# Altium schematic sheet Sheet2.SchDoc
size A; SheetNumber: 2; SheetTotal: 3; SPICEModelCacheSNXRSEFX: <root> / <DocumentId>SNXRSEFX</DocumentId> / <CacheFrame Number="0"> / <Model Name="lp5907_3p0_trans" Kind="CKT"> / <Text>**$ENCRYPTED_LIB / **$INTERFACE / * PSpice Model Editor - Version 16.2.0 / *$ / * LP5907_3P0 / ***************************************************************************** / * (C) Copyright 2017,2012 Texas Instruments Incorporated. All rights reserved. / ***************************************************************************** / ** This model is designed as an aid for customers of Texas Instruments. / ** TI and its licensors and suppliers make no warranties, either expressed / ** or implied, with respect to this model, including the warranties of / ** merchantability or fitness for a particular purpose. The model is / ** provided solely on an "as is" basis. The entire risk as to its quality / ** and performance is with the customer. / ***************************************************************************** / * / * This model is subject to change without notice. Texas Instruments / * Incorporated is not responsible for updating this model. / * / ***************************************************************************** / * / ** Released by: WEBENCH Design Center, Texas Instruments Inc. / * Part: LP5907_3P0 / * Date: 05JUN2017 / * Model Type: Transient / * Simulator: PSPICE / * Simulator Version: 16.2.0.p001 / * EVM Order Number: / * EVM Users Guide: / * Datasheet: SNVS798L APRIL 2012REVISED SEPTEMBER 2016 / * / * / * Model Version: Final 1.10 / * / ***************************************************************************** / * / * Updates: / * / * Final 1.10 / * Release to Web / *&lt;Made below changes to the model&gt; / * 1. Model supports floating ground and made compliant with new template. / * / * Final 1.00 / * Release to Web / * / ***************************************************************************** / * / * Model Usage Notes: / * / * 1. The following features have been modeled / *      a. Start-up time / *      b. PSSR / *      c. Enable/VIN shutdown / *      d. Load and line transients / *      e. Internal current limit / *      f. Model supports inverting topology. / * / * / * 2. Temperature effects &amp; Ground/quiescent current have not been modeled. / * / ***************************************************************************** / .SUBCKT LP5907_3P0_TRANS EN VIN VOUT N_C GND / $CDNENCSTART / eee8c5c7a2bc4b01f045f303678664e7916da0bae22e8cb0bba041dd67c69ce448ea70148a9ac1670c8926c1ac5057c8ccfcd77bf87ca9dc1f2237338a6ef39d / 0dea85bdd2f6170515f60e4ce62d5ce4f42b1ac717dd32555170a8e333648715f562e78474a33860560cb52aa9aabd08162db2a33972403f8ec095416ef1402c / 23ee73d6065f3641a60fd3951de4fe94e0b5dbf27fe7bf8f8855cd663d22bb25644126c9831a96bdc8e5a32375110da8033006ed9ac5d2d19e3592265a7ac25a / c9df73872fc604505141f95a167e875cb8368eb63c4c192b1dbaaf9d294d8e9748da025e697215716ac3f3c79dcf3e27303d7240d8c3139d1f2237338a6ef39d / c6ada2f6665016df0abfc569c2f155649bb0d004119ec15edac27046788386e08c268da1b8c6e14d7fe15ab6e0b5072f9f339ae728025ac59258806fc7cc43d8 / 6f9764b062a618461b335ff6669122153465e12ae9d7d9c7a434cb3c571aa35fcf8e67772046bd39de85e4e2d68b498f6dba65afb526cbc1a2029afaa2b4a68e / 0be1bd08545f4ec3706b807646b80371d6b573c4fef92654bdbd52ddbaa047e44f8bfb77fa42da9ca5c0f1a70fbc358fb8558acfd32419a886391aa7db33436a / 82d2e7992b7a58af706b807646b803716eccaf694fc8cbd852bd4e0d98b91e0393c1d0241c58b19c8c1b61a2a3408b1c3b31ab4d5157bebb045e35488dc8d857 / 96cc4b5209c35bf775963efd3ee34e16f562e78474a33860560cb52aa9aabd08162db2a33972403f2b4240fc250814d9757d9762d76573a2de58ab941dd37bc2 / cdaa385411811e27bfd81d659a09e4b32637e9cac2aa5cea2cecad1ebf804c4bf467148f06ca8e43b386cdd95d344e224c0b6f0d39a92da161003feb9e39e6bc / 5aa875be979324eb706b807646b803717dcd3f16f2f4a72c7eda79482ff3735885c2b9ec79784b734f171b0ac1178905b3e9d0eff77948c660f3e64cab793fd4 / 6dcc2999c2dfe559706b807646b8037152bd4e0d98b91e036547a759992af1d01ed3b068a02ead27a5c0f1a70fbc358fb8558acfd32419a886391aa7db33436a / 0a40497471b1851d706b807646b8037110fe20894a82e47899b87aceb23e86979bd52e24aaba9e8d7538df4596c8873b644126c9831a96bddad715ff2fd3051c / 311fb123761f1dd1939d8e8a60715c719bce09d5b25a2abbebab489077a612d43deed04c860f4203446c0a8b5840e648b6adb3acb41df66c7a119c9a925e903a / 999885ffe318eff0a5c0f1a70fbc358fb8558acfd32419a8e52b5eff4bb48eb945ddc6a4b72796469aa0f149b272f6822a0a30f438cac9930696f6a37d129d35 / e9f419af62bfe95eb585b96681e0ca9ba21192fade6c61218492e52ca990713774bd84a1f90ee88cdd6200a649fb305b94754a223418ccdb2be4545d89eca38c / 6d35d8485846d69902bd25eaa8c8a8117df3afe1fbfc11e3dc7abd4485ee9f8e6290bd1a849bbcaaf829d8c08e2df90b3e7542e0267ca578508313674356fb94 / 10f459d39ee6f8ae706b807646b80371a4f10b3120454571f2810f0bed6a6bb9267ed4ac3759fd051c6ffcdd96e3dd45844da759261db9861f2237338a6ef39d / 69ff18044fae7c89706b807646b8037152bd4e0d98b91e03a4a705036dcc71cc1471cd15dabb62faa5c0f1a70fbc358fb8558acfd32419a886391aa7db33436a / 1e36f10390632b7b706b807646b8037152bd4e0d98b91e03d126183a007ec7da5a3bd16bf5766b7522c2ca6031933b14abdc18ad19c6370052dba193271012d0 / bee3b1535c1d5d6b644126c9831a96bdc8e5a32375110da8033006ed9ac5d2d1afd69b5275785a510a61135c65b4240f7f2bbe2210c0cd5b5bc1a718246f5080 / 22cc75479b3d980a706b807646b8037180a93b86ccc5ef96b81e4c4d969f1dd2ca3bf768e25b6b29ac6a06391c26b0c664bcc0a497fc04bab60ed022882a5e96 / 1ac3d64a7ec42565706b807646b80371fafbb00062b4cc8e5a87424d006993fbf4ff3965adf04b6de23d827c2a5cdd2f1d40db20570fad7864386207709a88c4 / a8fd19f33527d4f2b045c149b70fbd518c268da1b8c6e14d7fe15ab6e0b5072f9f339ae728025ac5f9ddf8ad585c1707b0641cfbbf3b64bdb8c03661254f4d72 / cdaa385411811e27bfd81d659a09e4b32637e9cac2aa5cea2cecad1ebf804c4bf467148f06ca8e43b386cdd95d344e224c0b6f0d39a92da161003feb9e39e6bc / 54653036f112a7e5706b807646b80371989ff71a450f2d4f43ff7de80bac908e0b2915792e5120cd0afc85f6633d60b0042f0c0c78bb0deba2029afaa2b4a68e / 9d3782a54af54f6d706b807646b80371989ff71a450f2d4f880b50147c27929900877b91cd4279f39377af7e54bb163fc1303b74a0359d38f6c8b208a55c3008 / 8df0563ff6b12bcb706b807646b803717dcd3f16f2f4a72c970368879395e64fb108abd8f0d8760ca5c0f1a70fbc358fb8558acfd32419a886391aa7db33436a / f28257b2a3730294706b807646b80371a847f3fb487c186c2e10b6f40aa50ec73034a5f774424fca02bd25eaa8c8a8117df3afe1fbfc11e3642308046b4ea694 / a5d158a0fc11634f706b807646b8037180a93b86ccc5ef96dcdb6b3481be0e8956bfede5d11cc7ca4f171b0ac1178905b3e9d0eff77948c660f3e64cab793fd4 / e9f419af62bfe95ec12e63f53fc8b6c7080dbdc2111b05ac8137f3f5199c34a1ce5ec34e6f8ad1ca5a7677ff1b3f4c2798db71085172481be0e3731929278ec6 / 3487eaf1c64d3e9be98f5b980e01c859aa11a96fd77a05cac8e5a32375110da8033006ed9ac5d2d1afd69b5275785a510a61135c65b4240ff30e0e5d2ed91cb1 / ce7c56cb096546916589144859c4b12fb5f1c17ee7956303b386cdd95d344e224c0b6f0d39a92da103c1359a395fea4edf42d85a8257809120f58e0d0db27768 / e9f419af62bfe95ebc27f931268b4061080dbdc2111b05ac281216a7cb15249ace5ec34e6f8ad1cac13ffc8b6ae5cb2e4c21dace8c0b77c7ecd58aec06da121d / 5d078000650a8fa5907b99823f1386611647afe0495b1ace45b47fa4a900dd804f447fc7bfeaab9e02bd25eaa8c8a8117df3afe1fbfc11e3642308046b4ea694 / a3ce589fda26bc39706b807646b80371989ff71a450f2d4f552dbe3b9f96257d713efb65723a80ebd53698db8c1cb0e024fdfd9bb2e10b07b60ed022882a5e96 / f9b0e0bab8595c63706b807646b803710c93db79923e59d4d97ed74d8488316a1fd0fe96cad713b855371616c1c9f36f1c805e0c37824e95e89729e5d38ef58f / e9f419af62bfe95ecc0121b5e20e2076080dbdc2111b05acde91212396735d2ace5ec34e6f8ad1caf93f7b40a8e2bd3108c0f85e1bde808a956711648fdaafb1 / 0a74212461f65cb976d50cd002ed44083e433ab1299f423f6954020319aab50ff562e78474a33860560cb52aa9aabd08162db2a33972403f8ec095416ef1402c / bc8ee2299b220803beda7935c8aeca8d90d894e251243331dc0745283a910a9d564ac05b97e34c8c3343357705743cd11b1b8528953e7c05c5653993202dbdc5 / 02dac6cba784505e706b807646b8037180a93b86ccc5ef961fd0fe96cad713b8ec673e334d6e7ccd24fdfd9bb2e10b07a5c0f1a70fbc358fd92a745ddd778fe4 / b67df0d3ab862a12706b807646b80371a847f3fb487c186c7546fb5c8c4298ec3034a5f774424fca02bd25eaa8c8a8117df3afe1fbfc11e3642308046b4ea694 / bedb4c285028d3890abfc569c2f155648a39127aa9f8cf3378b54ce720b1001e5b9f79f666c8fe0048c4805203a5c1374f171b0ac1178905fd2707d3f952d1fb / 5637fcfd860683a92531ce9df5eb060381d6b57981cd92143fcc20578536d17e644126c9831a96bdc8e5a32375110da8033006ed9ac5d2d19e3592265a7ac25a / 48a94d11d238250f1e8d99a34d90bf6e62e88611cf6e71252d04475a671a0efda43968df6d6616e3b5582e7414710ac9644126c9831a96bddad715ff2fd3051c / e644fc3843e7ff1b15f60e4ce62d5ce4a468356d867f8b503a870bda96023ed7f6bdaa4da8832bb84f171b0ac1178905b3e9d0eff77948c660f3e64cab793fd4 / 336ab444b7c2ade71b335ff6669122150e68485587411f9a8492e52ca99071375bebda023e3dc91e71802e7452fd18b248c4805203a5c137f2f761ab7704e778 / a3f576b848cd34f915f60e4ce62d5ce4b8a226473598a56b027888eba959f92eb19075ca5679628a564ac05b97e34c8c3343357705743cd1f2b50d82304ae07a / 4036fe3bb1fccadcf45310c19b6b8ee599a0991fc74259832333a016061f78ba24fdfd9bb2e10b07a5c0f1a70fbc358fb8558acfd32419a886391aa7db33436a / 93d3808648446fd760c210771409cb2ee0b5dbf27fe7bf8f28012d945d685fb43bfc0ce7f97e07f14f171b0ac1178905b3e9d0eff77948c660f3e64cab793fd4 / 3d438685e8d81df08ce6c355cecd73173a9f2b15e1549f82d2cba97a6fa780a058b7694ea940380f4aad8c443740098ea8c91e20f198ecd4b60ed022882a5e96 / c0ff0c48b49f7f336b2aa09c0af3df1469b84f995ab9051c8e9fda988b24bba9c64d81576cf5798f00d3e0b087c737444f171b0ac1178905fd2707d3f952d1fb / c858d814c56a2bccc83805c2174809e89f01b7b69d9219a4f0974baff00f663252a385cff0ff5105bd64bf1a73d7cdffcdbbb8dee99590171f2237338a6ef39d / b0eb42ca922cce592fbfcc2b872ff946b18d7f6c9478f926749d13634498f34b68c3b9926e0df71ceaaf7045263d8c48311203d0aeae6b284549675fbefb5cdc / 878ea891db46c1cd9b17b472ccd6ffe7644126c9831a96bdc8e5a32375110da8033006ed9ac5d2d1afd69b5275785a510a61135c65b4240ff30e0e5d2ed91cb1 / be933631531f965902bd25eaa8c8a8117df3afe1fbfc11e3dc7abd4485ee9f8e6290bd1a849bbcaaf829d8c08e2df90b3e7542e0267ca578508313674356fb94 / 9afa1f10a7f457ea15f60e4ce62d5ce4268ffed78a3448457725dab847e703f63d1e66e16b42006a644126c9831a96bdc8e5a32375110da889a2796fbfb67ca0 / 5c2e262d493b312f305eaeda4ae775d7c195100027f00a3fba105b629766a2e000d3e0b087c737444f171b0ac1178905b3e9d0eff77948c660f3e64cab793fd4 / 5f41a7a4794b53672c4cbab029189320d042b92eba138a7c9f7df7e1d8537137dc26028ef70590f4b5f1c17ee7956303b386cdd95d344e22338cb575f6b9cea3 / ddf70eae3b592905a60fd3951de4fe94b6c5413836fc187c4b41ee992fe28b1ff562e78474a33860560cb52aa9aabd08162db2a33972403f8ec095416ef1402c / e0bee0f3fadd672460c210771409cb2ee0b5dbf27fe7bf8f1f2fb368fccc6be125d40f775a64a0940cafcb7cfe652d94bf1ee911780421dd1f2237338a6ef39d / f80a395284a571112fbfcc2b872ff9468e9fda988b24bba9e5e7fade4086c0d1d3b99b01fef3c644b016893e7e47cfd682b96d0b5ade7e97484379fba1bca2d2 / 062e5f2e0baf1b671b335ff6669122158a831dedbf5e05f78492e52ca99071374791d9b7e0db60db3efcea856e03cbcb8c268da1b8c6e14d89160f2754c96160 / 705d459f50f7a08c15f60e4ce62d5ce4b1e7b82b4260120d8f71e7553e806398042f0c0c78bb0deb564ac05b97e34c8c3343357705743cd1f2b50d82304ae07a / 394197bedeb77a71acab1d0766be876cdc171ccd3489847ae1dccbcbafa30549bf1ee911780421ddb386cdd95d344e224c0b6f0d39a92da161003feb9e39e6bc / b052355e65d40bda1e8d99a34d90bf6ec9ff7abb021b1d34250ab162ede77ed0bbc3d254e7d5d10548f47e6a1b8fd4c6a1943618832707cff2f761ab7704e778 / b90e0c5fe970b38760c210771409cb2e9bb0d004119ec15e777d4715d3c53dd141d49fca179af79dbaee13068f3f98a9dfe18481da70a6599d6bedf9d0034ac8 / 904e90e8e5b2fbfdf45310c19b6b8ee599a0991fc74259832333a016061f78ba24fdfd9bb2e10b07a5c0f1a70fbc358fb8558acfd32419a886391aa7db33436a / 615a28c46d72374094fbbbfac28a5c5c164c9e232793a5b0e99f6ae89c8b7ae302bd25eaa8c8a8117df3afe1fbfc11e3dc7abd4485ee9f8e06f446f73ef208be / 2f646e0e8d7ca9fb860341bb47536c89d3c6f4cd3b9e53669f7df7e1d853713798709113e7ea04d2b5f1c17ee7956303b386cdd95d344e22338cb575f6b9cea3 / 717cdf892ff6b6ffa60fd3951de4fe94f62cc45356863029bf1ee911780421ddb386cdd95d344e224c0b6f0d39a92da103c1359a395fea4e2547cfd16916d128 / 6a30044ee8eb8b67df94e35e4efbe801a81b64b03c55448366eaeb9fc4cc8ae1d7fdd13664b19a3da770ffc06755e0b9564ac05b97e34c8c1ec113823609ffcc / 2cfd781695004e385050367ff4393fd0f5957e86a35dee97669eef4894e6ebd591d2aeffe375b62981f87bf823608f41a6f0273a70365cec890995cd4f67537c / d8085d82d8686840ed8ce2e705c14ecfc8e5a32375110da8033006ed9ac5d2d1afd69b5275785a510a61135c65b4240f7f2bbe2210c0cd5b5bc1a718246f5080 / 47d63904790b4c5b964cb18042fc708b34fecbdc2e9ff42a885a6f1714ca32ab8b8d03f66b3294c2e1dfb3f47a4ac658dc67d6d46927fdbdf2f761ab7704e778 / $CDNENCFINISH / .ENDS LP5907_3P0_TRANS</Text> / </Model> / </CacheFrame> / </root>
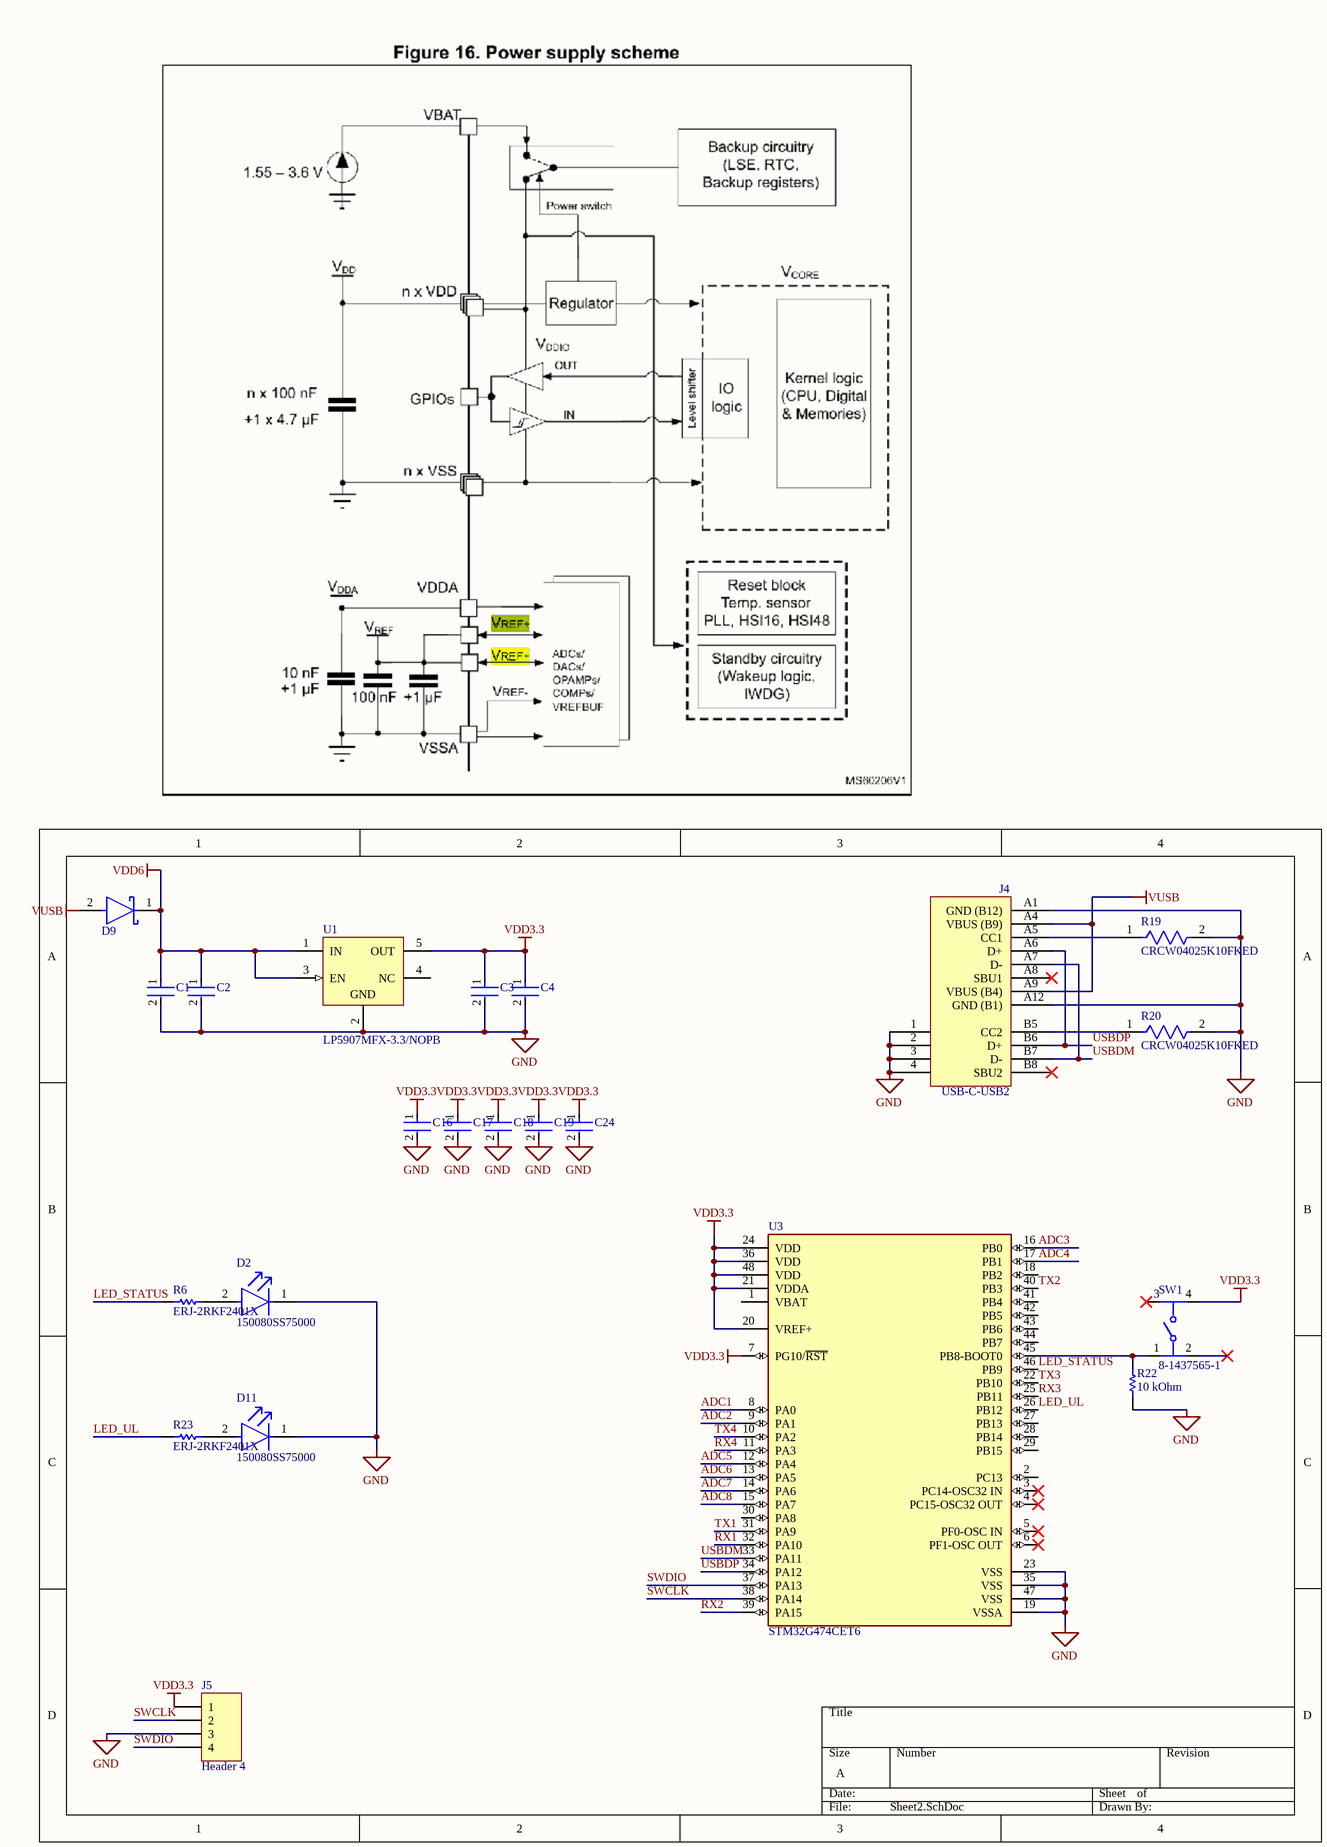
[diagram p0: Sheet2.SchDoc]

## Parts
C1  C0603C225K4PACTU  [FP-C0603C225K4PACTU-MFG]  (value not drawn)
C2  C0603C225K4PACTU  [FP-C0603C225K4PACTU-MFG]  (value not drawn)
C3  C0603C225K4PACTU  [FP-C0603C225K4PACTU-MFG]  (value not drawn)
C4  C0603C225K4PACTU  [FP-C0603C225K4PACTU-MFG]  (value not drawn)
C16  C0603C225K4PACTU  [FP-C0603C225K4PACTU-MFG]  (value not drawn)
C17  C0603C225K4PACTU  [FP-C0603C225K4PACTU-MFG]  (value not drawn)
C18  C0603C225K4PACTU  [FP-C0603C225K4PACTU-MFG]  (value not drawn)
C19  C0603C225K4PACTU  [FP-C0603C225K4PACTU-MFG]  (value not drawn)
C24  C0603C225K4PACTU  [FP-C0603C225K4PACTU-MFG]  (value not drawn)
D2  150080SS75000  [FP-150080SS75000-MFG]
D9  VS-10MQ100NTRPBF  [FP-95400-MFG]  (value not drawn)
D11  150080SS75000  [FP-150080SS75000-MFG]
J4  USB-C-USB2  [USB-C-USB4105]
J5  Header 4  [HDR1X4]
R6  ERJ-2RKF2401X  [RESC1005X40X25LL05T05]
R19  CRCW04025K10FKED  [FP-CRCW0402-e3-IPC_C]
R20  CRCW04025K10FKED  [FP-CRCW0402-e3-IPC_C]
R22  value 10 kOhm  [RESC1005X40X25LL05T10]  (hidden comment: RC0402FR-0710KL)
R23  ERJ-2RKF2401X  [RESC1005X40X25LL05T05]
SW1  8-1437565-1  [FP-8-1437565-1-MFG]
U1  LP5907MFX-3.3/NOPB  [DBV0005A_N]
U3  STM32G474CET6  [FP-STM32G474CET6-MFG]

## Nets
GND: C1.2 C2.2 C3.2 C4.2 C16.2 C17.2 C18.2 C19.2 C24.2 D2.1(C) D11.1(C) J4.1(CHASIS) J4.2(CHASIS) J4.3(CHASIS) J4.4(CHASIS) J4.A1(GND_(B12)) J4.A12(GND_(B1)) J5.3 R19.2 R20.2 R22.1 U1.2(GND) U3.19(VSSA) U3.23(VSS) U3.35(VSS) U3.47(VSS)
VDD3.3: C3.1 C4.1 C16.1 C17.1 C18.1 C19.1 C24.1 J5.1 SW1.4 U1.5(OUT) U3.7(PG10/~{RST}) U3.20(VREF+) U3.21(VDDA) U3.24(VDD) U3.36(VDD) U3.48(VDD)
VDD6: C1.1 C2.1 D9.1(C) U1.1(IN) U1.3(EN)
VUSB: D9.2(A) J4.A4(VBUS_(B9)) J4.A9(VBUS_(B4))
ADC1: U3.8(PA0)
ADC2: U3.9(PA1)
ADC3: U3.16(PB0)
ADC4: U3.17(PB1)
ADC5: U3.12(PA4)
ADC6: U3.13(PA5)
ADC7: U3.14(PA6)
ADC8: U3.15(PA7)
LED_STATUS: R6.1 U3.46(PB9)
LED_UL: R23.1 U3.26(PB12)
RX1: U3.32(PA10)
RX2: U3.39(PA15)
RX3: U3.25(PB11)
RX4: U3.11(PA3)
SWCLK: J5.2 U3.38(PA14)
SWDIO: J5.4 U3.37(PA13)
TX1: U3.31(PA9)
TX2: U3.40(PB3)
TX3: U3.22(PB10)
TX4: U3.10(PA2)
USBDM: J4.A7(D-) J4.B7(D-) U3.33(PA11)
USBDP: J4.A6(D+) J4.B6(D+) U3.34(PA12)
NetD2_2: D2.2(A) R6.2
NetD11_2: D11.2(A) R23.2
NetJ4_A5: J4.A5(CC1) R19.1
NetJ4_B5: J4.B5(CC2) R20.1
NetR22_2: R22.2 SW1.1 U3.45(PB8-BOOT0)

Not connected (* = marked no-connect by the designer): J4 A8(SBU1)* B8(SBU2)*; SW1 2* 3*; U1 4(NC); U3 1(VBAT) 2(PC13) 3(PC14-OSC32_IN)* 4(PC15-OSC32_OUT)* 5(PF0-OSC_IN)* 6(PF1-OSC_OUT)* 18(PB2) 27(PB13) 28(PB14) 29(PB15) 30(PA8) 41(PB4) 42(PB5) 43(PB6) 44(PB7)

## Library data of the parts
C1-C4 C16-C19 C24 = CMP-2006-02259-2: CAP CER 2.2UF 16V X5R 0603; Dielectric Material: Ceramic; Tolerance: 10%; Dissipation Factor: 5%; Series: C; Voltage Rating (DC): 16V; REACH SVHC: No SVHC; RoHS Compliant: Yes; Number of Pins: 2; Max Operating Temperature: 85°C; Voltage Rating: 16V; Min Operating Temperature: -55°C; Termination: SMD/SMT; Dielectric: X5R; Packaging: Tape and Reel; Contact Plating: Tin; Case Code (Metric): 1608; Height: 0.8mm; Capacitance: 2.2uF; Case/Package: 0603; Width: 0.8mm; Construction: Flat; Depth: 0.8mm; Thickness: 0.034inch; Radiation Hardening: No; Length: 1.6mm; Mount: Surface Mount; Case Code (Imperial): 0603; Voltage: 16V; Package Quantity: 1; Lead Free: Lead Free; LCSC: C23630
D2 D11 = CMP-1426-00010-2: LED RED CLEAR 0805 SMD; Forward Voltage: 1.9V; Luminous Intensity: 60mcd; Dominant Wavelength: 630nm; Forward Current: 30mA; Viewing Angle: 140°; Lens Color: Colorless; Test Current: 20mA; Lens Size: 1.25mm; Packaging: Cut Tape; Width: 1.25mm; Case Code (Metric): 2012; Max Operating Temperature: 85°C; RoHS Compliant: Yes; Mount: Surface Mount; Case/Package: 0805; Series: WL-SMCW; Length: 2mm; Case Code (Imperial): 0805; Wavelength: 630nm; Lens Style: Clear; Min Operating Temperature: -40°C; Color: Red; Lens Transparency: Clear; Package Quantity: 1; Height: 0.8mm; LCSC: C84256
D9 = CMP-02539-000001-1: DIODE SCHOTTKY 100V 1A SMA; Manufacturer: Vishay; Forward Current: 1.5A; Max Surge Forward Current: 30A; Standoff Height: 0mm; Value: 38pF; Max Junction Temp: +150°C; Peak Reverse Current: 0.1mA; Octopart: https://octopart.com/vs-10mq100ntrpbf-vishay-44340924; Max Repetitive Reverse Voltage: 100V; ComponentLink2Description: Datasheet; ComponentLink2URL: http://www.vishay.com/docs/94119/vs-10mq100ntrpbf.pdf; Reverse Voltage: 100V; Digikey Description: DIODE SCHOTTKY 100V 1A SMA; Mouser Description: DIODE SCHOTTKY 100V 1A SMA; Lead Free: Yes; Device Class L2: Diodes; Temperature Range Low: -55°C; Package: 95400; Height: 2.29mm; Capacitance: 38pF; Device Class L1: Discrete Semiconductors; Footprint Url: https://www.vishay.com/docs/95400/sma.pdf; Temperature: -55°C to +150°C; Temperature Range High: +150°C; RoHS: TRUE; Category: Diode; Manufacturer Part Number: VS-10MQ100NTRPBF; Device Class L3: Schottky Diodes; Automotive: No; LCSC: C14996
J4 = USB-C-USB2: MP: USB4105; MF: Global Connector Technology; LCSC: C2927039
J5 = Header 4: Header, 4-Pin; LatestRevisionDate: 17-Jul-2002; LatestRevisionNote: Re-released for DXP Platform.; Publisher: Altium Limited
R6 R23 = CMP-2002-00798-1: Manufacturer: Panasonic; Part Number: ERJ-2RKF2401X; LCSC: C25130
R19 R20 = CMP-1011-00590-4: RES Thick Film, 5.1kΩ, 1%, 0.063W, 100ppm/°C, 0402; Voltage Rating: 50V; Max Power Dissipation: 63mW; Resistance: 5.1kR; Case/Package: 0402; Min Operating Temperature: -55°C; Height: 0.35mm; Contact Plating: Tin; Tolerance: 1%; Max Operating Temperature: 155°C; Lead Free: Lead Free; Number of Terminations: 2; Temperature Coefficient: 100ppm/°C; Weight: 2.3E-05oz; Termination: SMD/SMT; Radiation Hardening: No; Voltage Rating (DC): 50V; Length: 1mm; Features: Automotive AEC-Q200; Case Code (Metric): 1005; Width: 0.02inch; Package Quantity: 10; Military Standard: Not; Depth: 0.5mm; Packaging: Tape and Reel; Power Rating: 63mW; Case Code (Imperial): 0402; Composition: Thick Film; LCSC: C25905
R22 = CMP-2002-07353-1: Manufacturer: Yageo / Phycomp; Part Number: RC0402FR-0710KL; LCSC: C25744
SW1 = CMP-03407-000016-1: SWITCH TACTILE SPST-NO 0.02A 15V; Actuator Length: 0.4mm; Actuator Material: Brass; Contact Current Rating: 20mA; Switch Travel: 0.25mm; Switch Function: Off-Mom; Electrical Life: 500000Cycles; Contact Resistance: 100mR; Illumination Type: Non-Illuminated; Operating Force: 1.57N; Actuator Type: Standard; Throw Configuration: SPST; Radiation Hardening: No; Orientation: Straight; Packaging: Tape and Reel; Type: Switch; Max Operating Temperature: 85°C; Contact Material: Copper Alloy; Package Quantity: 4000; Max Voltage Rating (DC): 15V; Contact Plating: Silver; Mechanical Life: 500000Cycles; Case/Package: SMD/SMT; RoHS Compliant: Yes; Series: FSMCT; Mount: Surface Mount; Max Current Rating: 20mA; ELV: Compliant; Voltage Rating (DC): 15V; Termination: Gull Wing; Min Operating Temperature: -35°C; LCSC: C318884
U1 = CMP-2000-07464-2: None; Power Supply Rejection Ratio (PSRR): 82dB; Accuracy: 2%; Output Type: Fixed; Min Input Voltage: 2.2V; Quiescent Current: 425uA; Max Output Current: 250mA; Output Voltage: 3.3V; Number of Outputs: 1; Polarity: Positive; Max Input Voltage: 5.5V; Dropout Voltage: 250mV; Output Voltage Accuracy: 2%; RoHS Compliant: Yes; Max Operating Temperature: 125°C; Contact Plating: Tin; Number of Pins: 5; Lead Free: Lead Free; Radiation Hardening: No; Mount: Surface Mount; Nominal Output Voltage: 3.3V; Case/Package: SOT-23; Packaging: Tape and Reel; Number of Regulators: 1; Min Operating Temperature: -40°C; Package Quantity: 3000; REACH SVHC: No SVHC; Output Current: 250mA; LCSC: C80670
U3 = CMP-12105-000053-1: MAINSTREAM ARM CORTEX-M4 CORE WI; Manufacturer: STMicroelectronics; Number Of Usb Channels: 1; Number Of Uart Channels: 4; Number Of Adc Channels: 20; Ram Size: 128KBytes; Standoff Height: 0.05mm; Number Of A/D Converters: 5; Number Of I/Os: 38; Max Supply Voltage: 3.6V; Frequency: 170MHz; Min Supply Voltage: 1.62V; Interface: I2C,SPI,UART,USART,CAN,USB,LIN,IrDA,I2S,SMBus,Other; Memory Size: 512KBytes; Max Junction Temp: +105°C; Number Of Spi Channels: 3; Number Of Pwm Channels: 12; Memory Type: FLASH; Number Of Timers/Counters: 14; Data Bus Width: 32bits; Temperature Range Low: -40°C; RoHS: TRUE; Automotive: No; Octopart: https://octopart.com/stm32g474cet6-stmicroelectronics-99072248; ComponentLink2URL: https://www.st.com/resource/en/datasheet/stm32g474ce.pdf; Ambient Temperature Range Low: -40°C; Temperature Range High: +85°C; Manufacturer Part Number: STM32G474CET6; Ambient Temperature Range High: +85°C; ComponentLink2Description: Datasheet; Device Class L1: Integrated Circuits (ICs); Temperature: -40°C to +85°C; Device Class L3: Microcontrollers; Number Of I2C Channels: 4; Device Class L2: Embedded Processors and Controllers; Category: IC; Mouser Description: Cortex M4 512K LQFP48 85°C; Number Of Cores: 1; Digikey Description: MAINSTREAM ARM CORTEX-M4 CORE WI; Core Architecture: ARM Cortex-M4; Height: 1.6mm; Package: LQFP48; Lead Free: Yes; LCSC: C730125